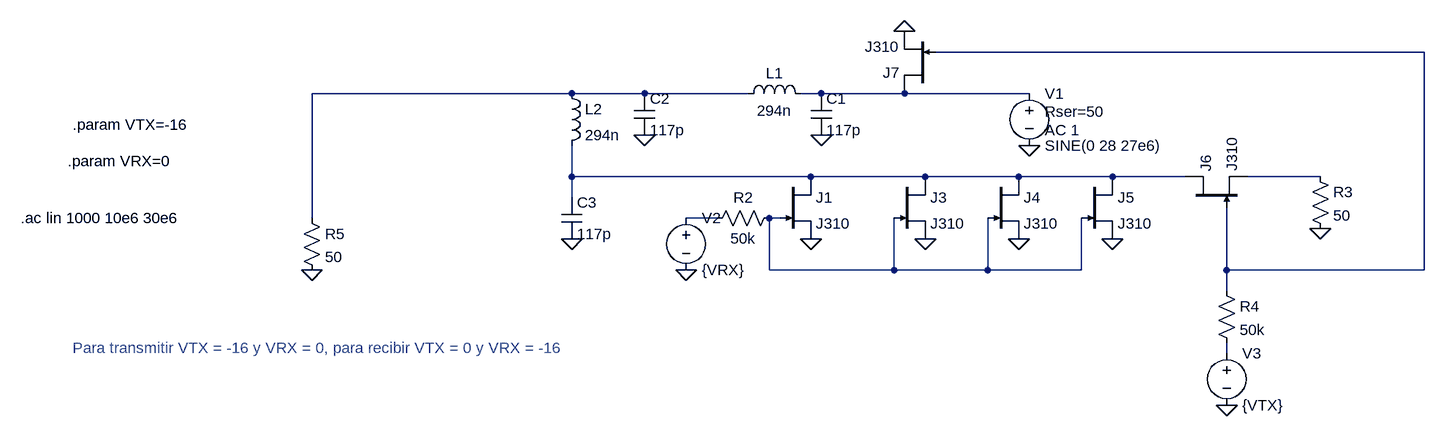
[diagram p0: schematic Quarter_wave_rf_switch.asc]
Quarter_wave_rf_switch.asc, the LTspice schematic file:
Version 4
SHEET 1 1912 696
WIRE 1696 -144 944 -144
WIRE 384 -80 -16 -80
WIRE 496 -80 384 -80
WIRE 656 -80 496 -80
WIRE 768 -80 736 -80
WIRE 896 -80 768 -80
WIRE 1088 -80 896 -80
WIRE 384 48 384 0
WIRE 752 48 384 48
WIRE 928 48 752 48
WIRE 1072 48 928 48
WIRE 1216 48 1072 48
WIRE 1328 48 1216 48
WIRE 1536 48 1424 48
WIRE 384 80 384 48
WIRE -16 112 -16 -80
WIRE 608 112 560 112
WIRE 704 112 688 112
WIRE 688 192 688 112
WIRE 880 192 880 112
WIRE 880 192 688 192
WIRE 1024 192 1024 112
WIRE 1024 192 880 192
WIRE 1168 192 1168 112
WIRE 1168 192 1024 192
WIRE 1392 192 1392 96
WIRE 1696 192 1696 -144
WIRE 1696 192 1392 192
WIRE 1392 224 1392 192
WIRE 1392 320 1392 304
FLAG -16 192 0
FLAG 768 -16 0
FLAG 496 -16 0
FLAG 384 144 0
FLAG 752 144 0
FLAG 560 192 0
FLAG 928 144 0
FLAG 1072 144 0
FLAG 1216 144 0
FLAG 1536 128 0
FLAG 1392 400 0
FLAG 896 -176 0
FLAG 1088 0 0
SYMBOL cap 752 -80 R0
SYMATTR InstName C1
SYMATTR Value 117p
SYMBOL ind 640 -64 R270
WINDOW 0 32 56 VTop 2
WINDOW 3 5 56 VBottom 2
SYMATTR InstName L1
SYMATTR Value 294n
SYMBOL cap 480 -80 R0
SYMATTR InstName C2
SYMATTR Value 117p
SYMBOL ind 368 -96 R0
SYMATTR InstName L2
SYMATTR Value 294n
SYMBOL cap 368 80 R0
SYMATTR InstName C3
SYMATTR Value 117p
SYMBOL njf 704 48 R0
SYMATTR InstName J1
SYMATTR Value J310
SYMBOL voltage 560 96 R0
WINDOW 123 0 0 Left 0
WINDOW 39 0 0 Left 0
SYMATTR InstName V2
SYMATTR Value {VRX}
SYMBOL res 704 96 R90
WINDOW 0 0 56 VBottom 2
WINDOW 3 32 56 VTop 2
SYMATTR InstName R2
SYMATTR Value 50k
SYMBOL njf 880 48 R0
SYMATTR InstName J3
SYMATTR Value J310
SYMBOL njf 1024 48 R0
SYMATTR InstName J4
SYMATTR Value J310
SYMBOL njf 1168 48 R0
SYMATTR InstName J5
SYMATTR Value J310
SYMBOL res 1520 32 R0
SYMATTR InstName R3
SYMATTR Value 50
SYMBOL njf 1328 96 R270
SYMATTR InstName J6
SYMATTR Value J310
SYMBOL voltage 1392 304 R0
WINDOW 123 0 0 Left 0
WINDOW 39 0 0 Left 0
SYMATTR InstName V3
SYMATTR Value {VTX}
SYMBOL res 1376 208 R0
SYMATTR InstName R4
SYMATTR Value 50k
SYMBOL res -32 96 R0
SYMATTR InstName R5
SYMATTR Value 50
SYMBOL njf 944 -80 R180
SYMATTR InstName J7
SYMATTR Value J310
SYMBOL voltage 1088 -96 R0
WINDOW 123 24 72 Left 2
WINDOW 39 24 44 Left 2
SYMATTR Value2 AC 1
SYMATTR SpiceLine Rser=50
SYMATTR InstName V1
SYMATTR Value SINE(0 28 27e6)
TEXT -464 112 Left 2 !.ac lin 1000 10e6 30e6
TEXT -392 24 Left 2 !.param VRX=0
TEXT -384 -32 Left 2 !.param VTX=-16
TEXT -384 312 Left 2 ;Para transmitir VTX = -16 y VRX = 0, para recibir VTX = 0 y VRX = -16

The netlist it stands for:
* Quarter_wave_rf_switch.asc
C1 N003 0 117p
L1 N002 N003 294n
C2 N002 0 117p
L2 N002 N004 294n
C3 N004 0 117p
J1 N004 N007 0 J310
V2 N006 0 {VRX}
R2 N007 N006 50k
J3 N004 N007 0 J310
J4 N004 N007 0 J310
J5 N004 N007 0 J310
R3 N005 0 50
J6 N004 N001 N005 J310
V3 N008 0 {VTX}
R4 N001 N008 50k
R5 N002 0 50
J7 N003 N001 0 J310
V1 N003 0 SINE(0 28 27e6) AC 1 Rser=50
.model NJF NJF
.model PJF PJF
.lib standard.jft
.ac lin 1000 10e6 30e6
.param VRX=0
.param VTX=-16
* Para transmitir VTX = -16 y VRX = 0, para recibir VTX = 0 y VRX = -16
.backanno
.end